# Altium schematic sheet USB-PROG-UART.SchDoc
size A; SheetNumber: 4; SheetTotal: 5
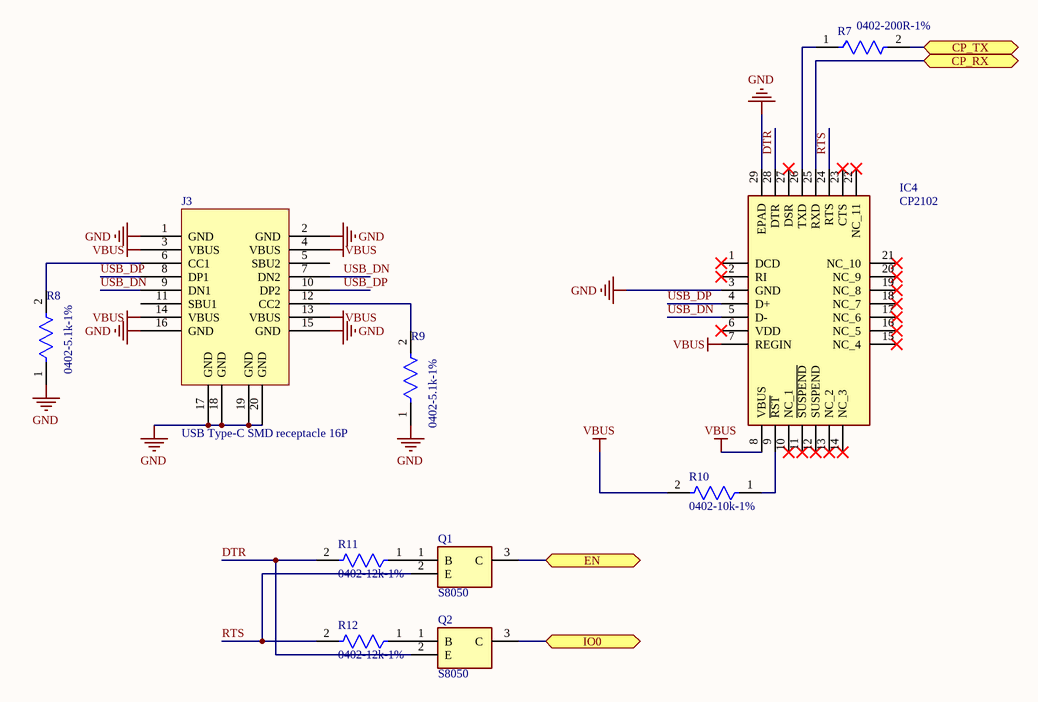
[diagram p0: USB-PROG-UART.SchDoc]

## Parts
IC4  CP2102  [QFN50P500X500X100-29N-D]
J3  USB Type-C SMD receptacle 16P  [USB Type-C SMD receptacle 16P]
Q1  S8050  [SOT95P240X115-3N]
Q2  S8050  [SOT95P240X115-3N]
R7  0402-200R-1%  [FP-CRCW0402-e3-IPC_C]
R8  0402-5.1k-1%  [FP-CRCW0402-e3-IPC_C]
R9  0402-5.1k-1%  [FP-CRCW0402-e3-IPC_C]
R10  0402-10k-1%  [FP-CRCW0402-e3-IPC_C]
R11  0402-12k-1%  [FP-CRCW0402-e3-IPC_C]
R12  0402-12k-1%  [FP-CRCW0402-e3-IPC_C]

## Ports
CP_RX (bidir, see ESP32[3B]), CP_TX (bidir, see ESP32[3B]), EN (bidir, see ESP32[1C]), IO0 (bidir, see ESP32[2B])

## Nets
GND: IC4.3(GND) IC4.29(EPAD) J3.1(GND) J3.2(GND) J3.15(GND) J3.16(GND) J3.17(GND) J3.18(GND) J3.19(GND) J3.20(GND) R8.1 R9.1
VBUS: IC4.7(REGIN) IC4.8(VBUS) J3.3(VBUS) J3.4(VBUS) J3.13(VBUS) J3.14(VBUS) R10.2
CP_RX: IC4.25(RXD) ; port CP_RX
CP_TX: R7.2 ; port CP_TX
DTR: IC4.28(DTR) Q2.2(E) R11.2
EN: Q1.3(C) ; port EN
IO0: Q2.3(C) ; port IO0
RTS: IC4.24(RTS) Q1.2(E) R12.2
USB_DN: IC4.5(D-) J3.7(DN2) J3.9(DN1)
USB_DP: IC4.4(D+) J3.8(DP1) J3.10(DP2)
NetIC4_9: IC4.9(~{RST}) R10.1
NetIC4_26: IC4.26(TXD) R7.1
NetJ3_6: J3.6(CC1) R8.2
NetJ3_12: J3.12(CC2) R9.2
NetQ1_1: Q1.1(B) R11.1
NetQ2_1: Q2.1(B) R12.1

Not connected (* = marked no-connect by the designer): IC4 1(DCD)* 2(RI)* 6(VDD)* 10(NC_1)* 11(~{SUSPEND})* 12(SUSPEND)* 13(NC_2)* 14(NC_3)* 15(NC_4)* 16(NC_5)* 17(NC_6)* 18(NC_7)* 19(NC_8)* 20(NC_9)* 21(NC_10)* 22(NC_11)* 23(CTS)* 27(DSR)*; J3 5(SBU2) 11(SBU1)

## Library data of the parts
IC4 = CP2102: Integrated Circuit; Manufacturer_Name: Silicon Labs; Datasheet Link: https://componentsearchengine.com/Datasheets/1/CP2102.pdf; Height: 1mm; Manufacturer_Part_Number: CP2102; Mouser Part Number: 634-CP2102; Mouser Price/Stock: https://www.mouser.co.uk/ProductDetail/Silicon-Labs/CP2102?qs=ucY0lxHzU7615lOm95XT0w%3D%3D
Q1 Q2 = S8050: Transistor; Manufacturer_Name: Yenji Elec; Datasheet Link: https://datasheet.lcsc.com/szlcsc/Yenji-Elec-S8050_C139514.pdf; Height: 1.15mm; Manufacturer_Part_Number: S8050
R7-R12 = CMP-2002-08122-2: RES Thick Film, 0Ω, 0.063W, 0402; Tolerance: 5%; Max Power Dissipation: 63mW; Voltage Rating: 50V; Temperature Coefficient: 100ppm/°C; Resistance: 0mR; Contact Plating: Tin; Height: 0.35mm; Radiation Hardening: No; Features: Automotive AEC-Q200; Composition: Thick Film; Width: 0.5mm; Weight: 2.3E-05oz; Termination: SMD/SMT; Packaging: Tape and Reel; Mount: Surface Mount; Case Code (Metric): 1005; Military Standard: Not; Min Operating Temperature: -55°C; Number of Terminations: 2; Package Quantity: 1; Case Code (Imperial): 0402; Depth: 0.5mm; Max Operating Temperature: 155°C; Case/Package: 0402; Power Rating: 63mW; Lead Free: Lead Free; Voltage Rating (DC): 50V; Length: 1mm